# Altium schematic sheet 3V3_REG.SchDoc
size B; SheetNumber: 9; SheetTotal: 20
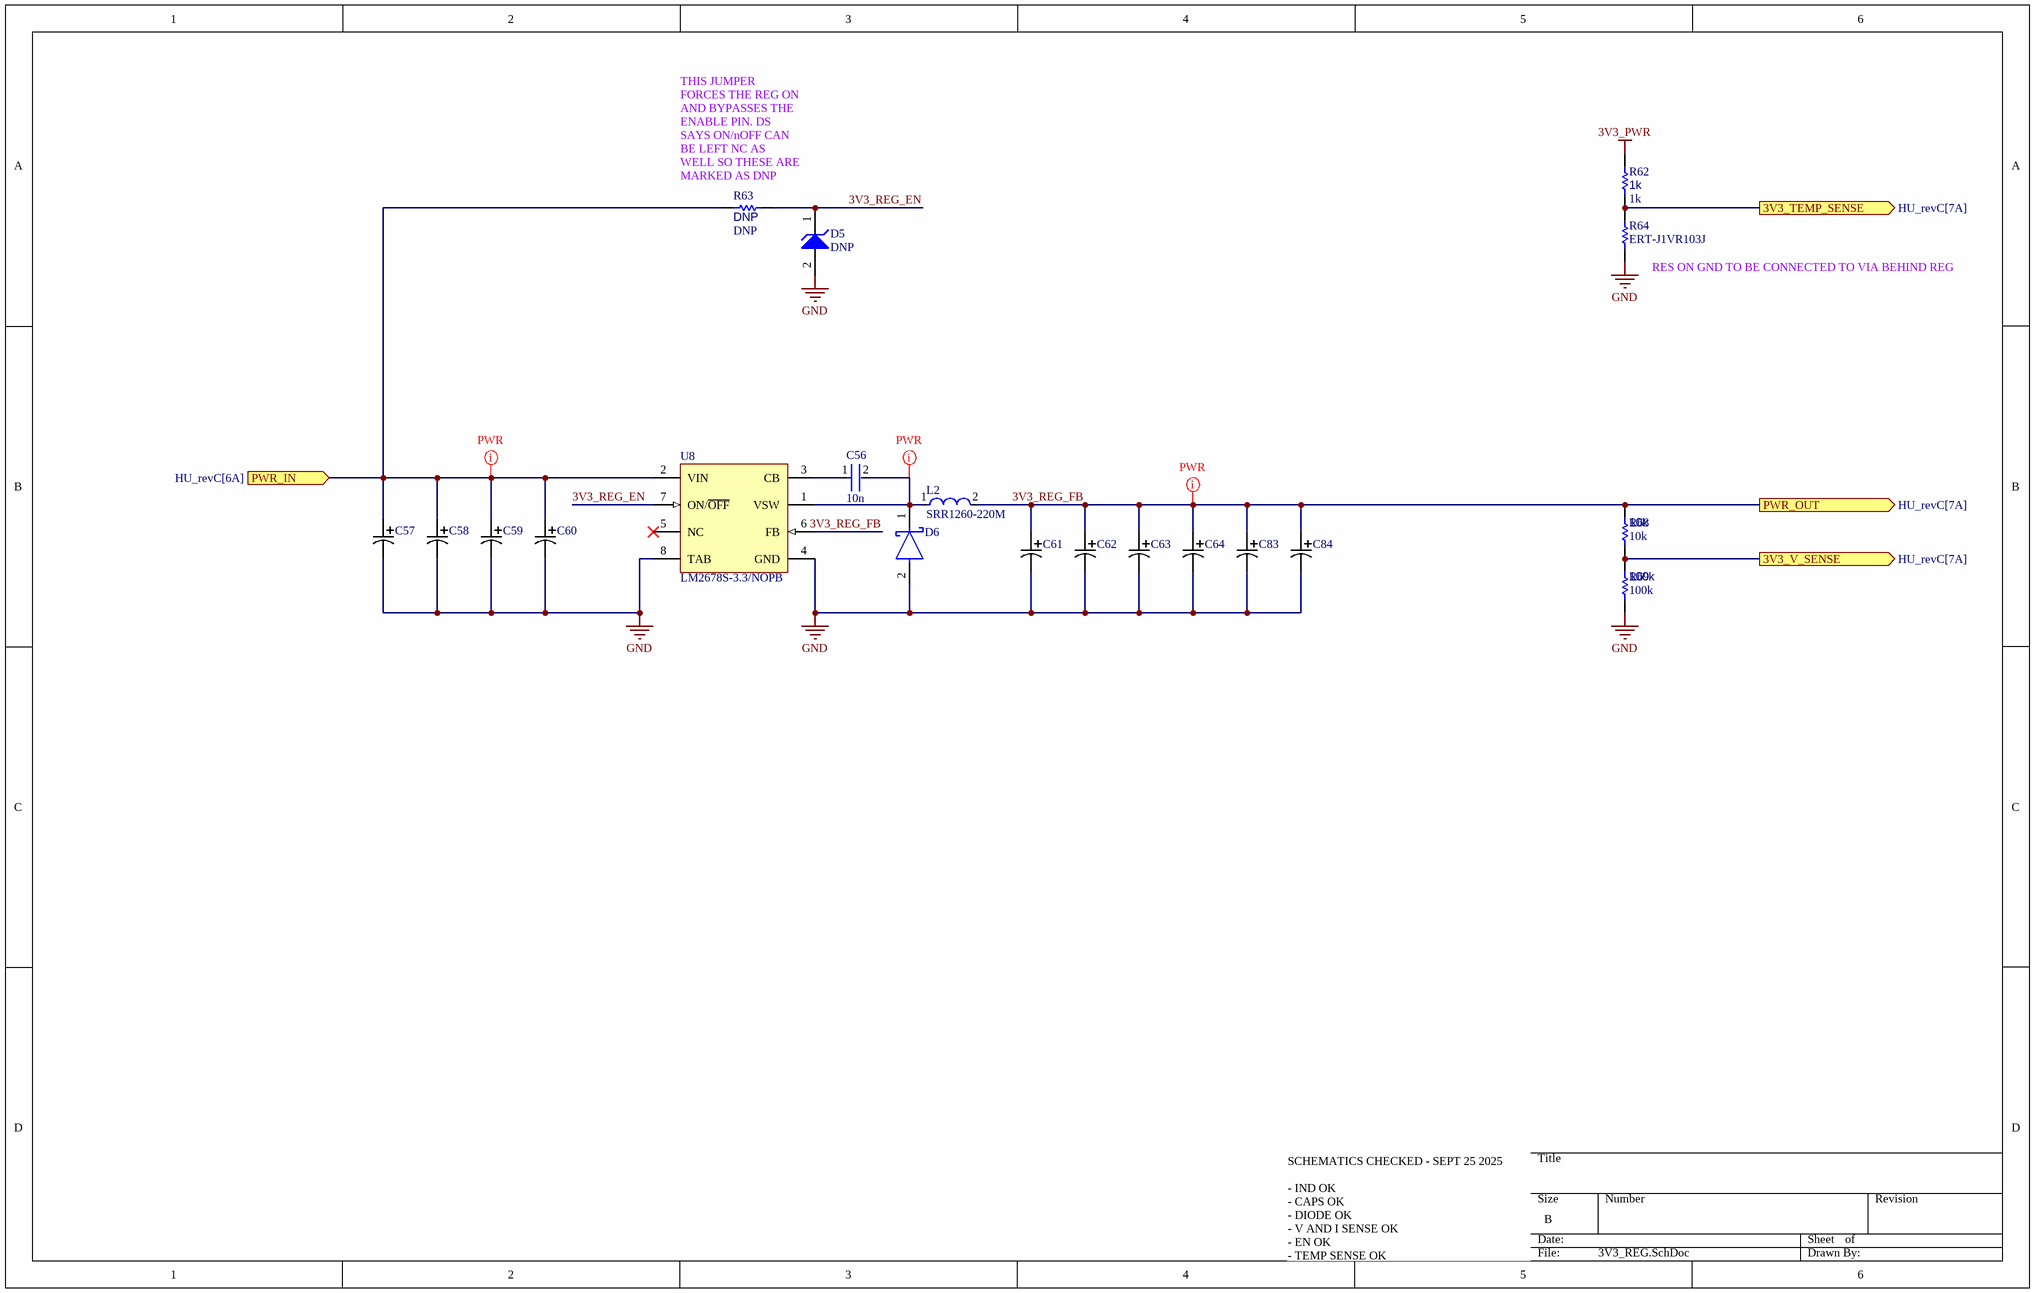
[diagram p0: 3V3_REG.SchDoc]

## Parts
C56  10n  [FP-0402-L_1_0_0_05-W_0_5-IPC_A]
C57  T495D475K050ATE300  [T495D475K050ATE300-Footprint-1]  (value not drawn)
C58  T495D475K050ATE300  [T495D475K050ATE300-Footprint-1]  (value not drawn)
C59  T495D475K050ATE300  [T495D475K050ATE300-Footprint-1]  (value not drawn)
C60  T495D475K050ATE300  [T495D475K050ATE300-Footprint-1]  (value not drawn)
C61  T495X107K020ATE150  [T495D337K010ATE150-Footprint-1]  (value not drawn)
C62  T495X107K020ATE150  [T495D337K010ATE150-Footprint-1]  (value not drawn)
C63  T495X107K020ATE150  [T495D337K010ATE150-Footprint-1]  (value not drawn)
C64  DNP  [T495D337K010ATE150-Footprint-1]  (value not drawn)
C83  DNP  [T495D337K010ATE150-Footprint-1]  (value not drawn)
C84  DNP  [T495D337K010ATE150-Footprint-1]  (value not drawn)
D5  DNP  [ONSC-SOD-523-2-502-01_V]
D6  B540C-13-F  [FP-SMC-MFG]  (value not drawn)
L2  SRR1260-220M  [FP-SRR1260-MFG]
R62  1k  [R0603B]
R63  DNP  [R0603B]
R64  ERT-J1VR103J  [RESC1608X90X30ML15T20]
R68  10k  [R0603B]
R69  100k  [R0603B]
U8  LM2678S-3.3/NOPB  [KTW0007B_N]

## Ports
3V3_TEMP_SENSE (out, see HU_revC[7A]), 3V3_V_SENSE (out, see HU_revC[7A]), PWR_IN (in, see HU_revC[6A]), PWR_OUT (out, see HU_revC[7A])

## Nets
3V3_PWR: R62.1
GND: C57.2 C58.2 C59.2 C60.2 C61.2 C62.2 C63.2 C64.2 C83.2 C84.2 D5.2(A) D6.2(A) R64.1 R69.1 U8.4(GND) U8.8(TAB)
3V3_REG_EN: D5.1(K) R63.2 U8.7(ON/~{OFF})
3V3_REG_FB: C61.1 C62.1 C63.1 C64.1 C83.1 C84.1 L2.2 R68.2 U8.6(FB) ; port PWR_OUT
3V3_TEMP_SENSE: R62.2 R64.2 ; port 3V3_TEMP_SENSE
3V3_V_SENSE: R68.1 R69.2 ; port 3V3_V_SENSE
PWR_IN: C57.1 C58.1 C59.1 C60.1 R63.1 U8.2(VIN) ; port PWR_IN
NetC56_1: C56.1 U8.3(CB)
NetC56_2: C56.2 D6.1(C) L2.1 U8.1(VSW)

Not connected (* = marked no-connect by the designer): U8 5(NC)*

## Layout directives
net class PWR: 3V3_REG_FB, NetC56_2, PWR_IN

## Notes on the sheet
- (near R63) THIS JUMPER FORCES THE REG ON AND BYPASSES THE ENABLE PIN. DS SAYS ON/nOFF CAN BE LEFT NC AS WELL SO THESE ARE MARKED AS DNP
- (near R64) RES ON GND TO BE CONNECTED TO VIA BEHIND REG
- SCHEMATICS CHECKED - SEPT 25 2025
  - IND OK
  - CAPS OK
  - DIODE OK
  - V AND I SENSE OK
  - EN OK
  - TEMP SENSE OK

## Library data of the parts
C56 = CMP-001-00058-1: LARGE PADS, 0402 CAP, CHANGE COMMENT TO MATCH REAL P/N; Capacitor Type: Ceramic; Min Operating Temperature: -55°C; Mounting Technology: Surface Mount; Pins: 2; Case/Package: 0402; RoHS Compliant: Yes; Max Operating Temperature: 85°C
C57-C60 = CMP-001-00066-2: Cap Tant Solid 4.7uF 50V D CASE 10% (7.3 X 4.3 X 2.8mm) SMD 7343-31 0.3 Ohm 125 C T/R; Value: 4.7µF; Min Operating Temperature: -55°C; Voltage Rating: 50V; Tolerance: 10%; Mounting Technology: Surface Mount; Max Operating Temperature: 125°C; Case/Package: 7343-31; Pins: 2
C61-C63 C83 = CMP-001-00067-2: T495X107K020ATE150 diff p/n; Tolerance: 10%; Voltage Rating: 10V; Value: 330µF; Case/Package: 2917; Min Operating Temperature: -55°C; Mounting Technology: Surface Mount; Max Operating Temperature: 125°C
C64 C84 = CMP-001-00067-2: Tolerance: 10%; Voltage Rating: 10V; Value: 330µF; Case/Package: 2917; Min Operating Temperature: -55°C; Mounting Technology: Surface Mount; Max Operating Temperature: 125°C
D5 = CMP-1060-00750-1: Zener Voltage Regulator, 500 mW, 2-Pin SOD-523, Pb-Free, Tape and Reel; Manufacturer: On Semiconductor; PartNumber: MM5Z3V3T1G; P Max (W): 0.5; VZ Typ (V): 3.3; RoHS: Pb-Free; ComponentLink2Description: Datasheet; PackageReference: SOD-523-2-502-01; DatasheetVersion: Rev. 10; ComponentLink1Description: Manufacturer URL; PackageVersion: Rev. E, 09/2010; ComponentLink3URL: http://www.onsemi.com/pub_link/Collateral/502-01.PDF; ComponentLink2URL: http://www.onsemi.cn/pub_link/Collateral/MM5Z2V4T1-D.PDF; Mounting Technology: Surface Mount; Packing: Tape and Reel; PackageDescription: 2-Pin SOD, Body 1.2 x 0.8 mm; ComponentLink1URL: http://www.onsemi.com/; ComponentLink3Description: Package Specification
D6 = CMP-2000-05097-3: DIODE SCHOTTKY 40V 5A SMC; Manufacturer: Diodes Inc.; Automotive Grade: NA; Peak Reverse Current: 0.5mA; Value: 300pF; Max Junction Temp: +150°C; Max Surge Forward Current: 100A; Standoff Height: 0.1mm; Digikey Description: DIODE SCHOTTKY 40V 5A SMC; Temperature Range Low: -55°C; Manufacturer Part Number: B540C-13-F; Octopart: https://octopart.com/b540c-13-f-diodes+inc.-325873; Lead Free: Yes; Reverse Voltage: 40V; RoHS: TRUE; Category: Diode; Mouser Description: Diode: Schottky rectifying; SMD; 40V; 5A; SMC; Package: reel, tape; ComponentLink2Description: Datasheet; Temperature Range High: +150°C; Automotive: No; Footprint Url: https://www.diodes.com/assets/Package-Files/SMC.pdf; Device Class L3: Schottky Diodes; Height: 2.5mm; Forward Current: 5A; Temperature: -55°C to +150°C; Package: SMC; ComponentLink2URL: https://www.diodes.com/assets/Datasheets/ds13012.pdf; Device Class L2: Diodes; Max Repetitive Reverse Voltage: 40V; Device Class L1: Discrete Semiconductors; Capacitance: 300pF
L2 = CMP-2000-07146-2: DIFF P/N: SRR1260-220M / FIXED IND 22UH 5A 27 MOHM SMD; Q Factor: 25; Sample Rate (Hz): 100kHz; Resistance: 27MR; Material: Steel; Inductance Tolerance: 20%; Inductance: 15uH; Frequency: 17.6MHz; Saturation Current: 4.6A; Core Material: Ferrite; Shielding: Shielded; Series: SRR1260; Termination: SMD/SMT; Packaging: Tape and Reel; RoHS Compliant: Yes; Height - Seated (Max): 0.256inch; Depth: 12.8mm; Case/Package: 1260; Height: 6mm; Number of Pins: 2; Mount: Surface Mount; Min Operating Temperature: -40°C; Test Frequency: 100kHz; Length: 12.5mm; Self Resonant Frequency: 17.6MHz; Current Rating: 5A; Tolerance: 20%; RMS Current (Irms): 5A; REACH SVHC: No SVHC; Resistor Type: Wirewound; DC Resistance (DCR): 27mR; Width: 12.5mm; Package Quantity: 600; DC Current: 5A; Max DC Current: 5A; Max Operating Temperature: 125°C; Military Standard: Not
R62 R63 R68 R69 = CMP-009-00002-14: Resistor
  R62: Value: 1k
  R63: Value: DNP
  R68: Value: 10k
  R69: Value: 100k
R64 = CMP-2000-00869-1: Manufacturer: Panasonic; Part Number: ERT-J1VR103J
U8 = CMP-0069-00195-3: SIMPLE SWITCHER® High Efficiency 5A Step-Down Voltage Regulator, 7-pin TO-263, Pb-Free; Manufacturer: Texas Instruments; PackageTopMarking: NSUZXYTTE#*LM2678*S-3.3; PowerWise: N; PackageReference: KTW0007B; Code_JEDEC: MO-169-AC; CompType: Switcher; RoHS: Y; PackageDescription: TO-263, Molded, .400 x .390 x .180in Body, 7 Lead, .050in Pitch, Surface Mount; ComponentLink1Description: Datasheet URL; PinCount: 7; ComponentLink1URL: http://www.ti.com/general/docs/lit/getliterature.tsp?genericPartNumber=LM2678&fileType=pdf